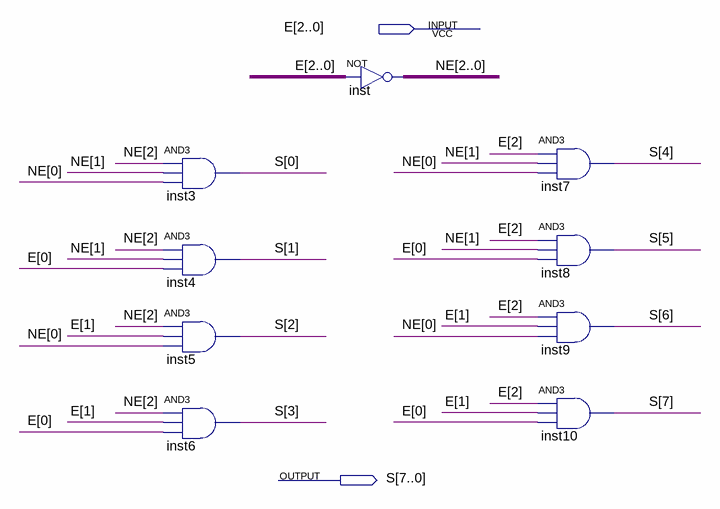
[diagram p0: schematic sheet]
// Quartus schematic DECOD3b8b.bdf as structural Verilog: 9 symbols, 2 pins
module DECOD3b8b (
  input  [2:0] E,
  output [7:0] S
);

  wire [2:0] NE;

  and inst3 (S[0], NE[2], NE[1], NE[0]);
  and inst4 (S[1], NE[2], NE[1], E[0]);
  and inst5 (S[2], NE[2], E[1], NE[0]);
  and inst6 (S[3], NE[2], E[1], E[0]);
  assign NE = ~E;  // NOT inst, 3 bits wide
  and inst7 (S[4], E[2], NE[1], NE[0]);
  and inst8 (S[5], E[2], NE[1], E[0]);
  and inst9 (S[6], E[2], E[1], NE[0]);
  and inst10 (S[7], E[2], E[1], E[0]);
endmodule
